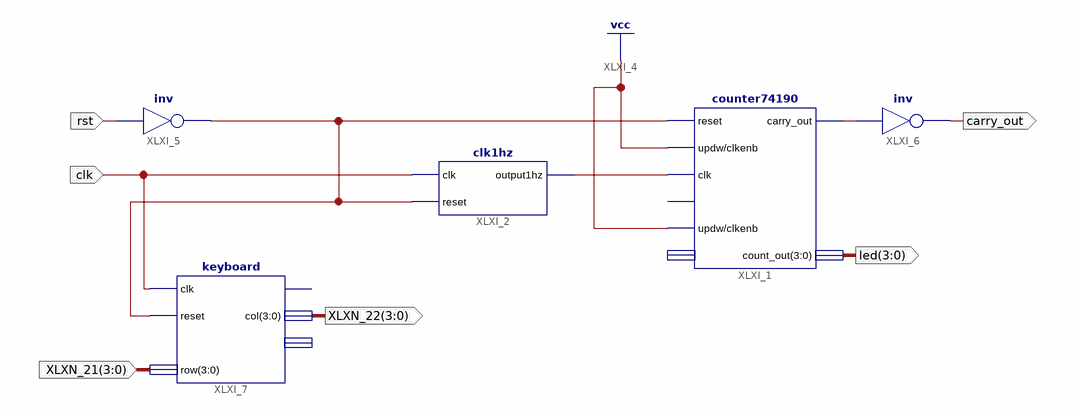
[diagram p0: schematic sheet 1]
// Xilinx ISE schematic topmodule.sch (spartan3e) as structural Verilog: 5 symbols, 6 ports
module topmodule (
  input  clk,
  input  rst,
  input  [3:0] XLXN_21,
  output [3:0] led,
  output carry_out,
  output [3:0] XLXN_22
);

  wire XLXN_1, XLXN_18, XLXN_20;

  counter74190 XLXI_1 (
    .reset(XLXN_20), .updw(1'b1), .clk(XLXN_1), .clkenb(1'b1), .carry_out(XLXN_18), .count_out(led));  // open: loadenb, load_in
  clk1hz XLXI_2 (.clk(clk), .reset(XLXN_20), .output1hz(XLXN_1));
  not XLXI_6 (carry_out, XLXN_18);
  keyboard XLXI_7 (.clk(clk), .reset(XLXN_20), .row(XLXN_21), .col(XLXN_22));  // open: valid, codeout
  not XLXI_5 (XLXN_20, rst);
endmodule
